# EAGLE design breakout (EAGLE 6.5.0)
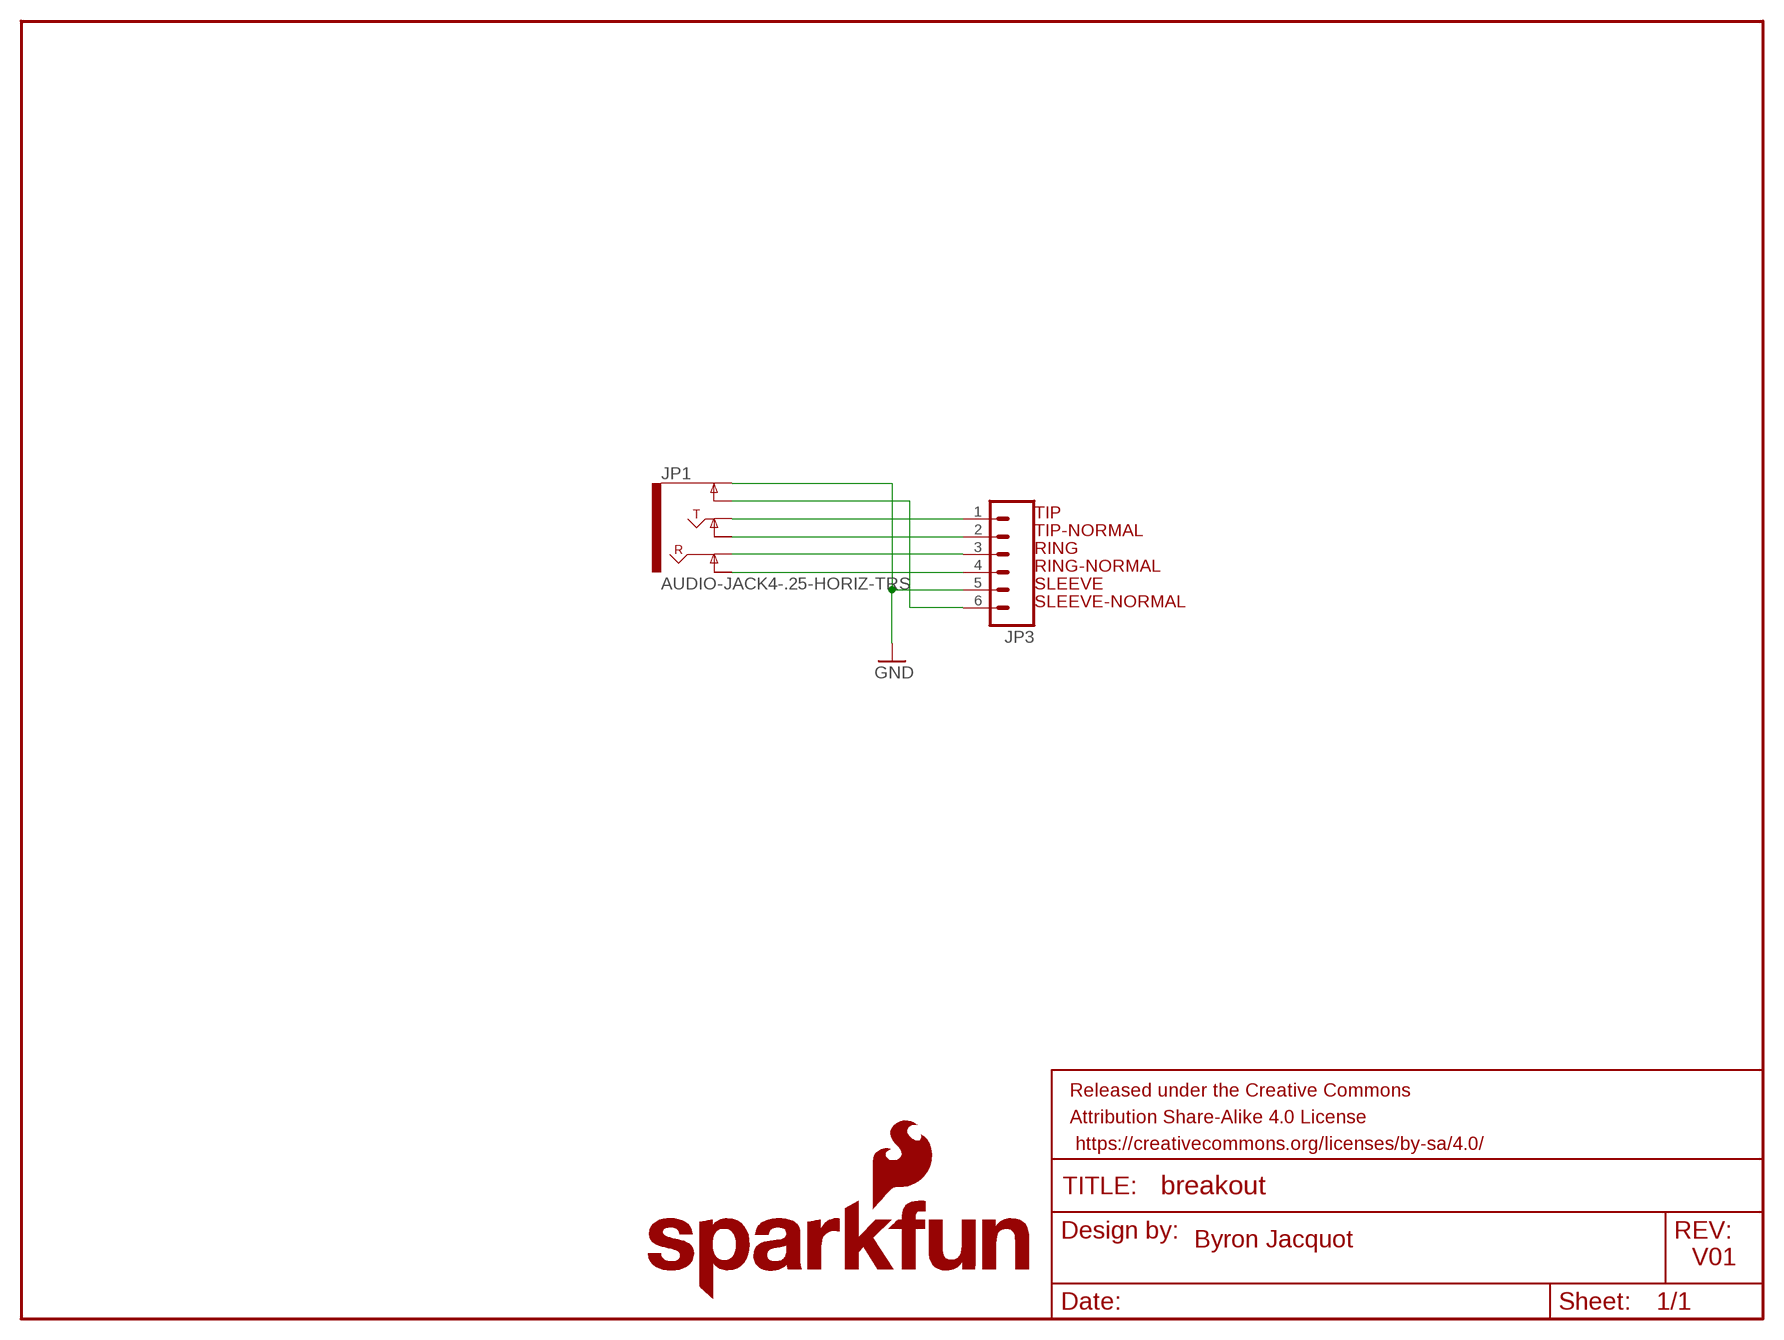
[diagram p0: schematic, sheet 1]

## Parts
FRAME1  FRAME-LETTER  [CREATIVE_COMMONS]
JP1  AUDIO-JACK4-.25-HORIZ-TRS  [AUDIO-JACK-.25-INCH-HORIZ-PTH]
JP3  M06NO_SILK  [1X06_NO_SILK]
LOGO1  SFE_LOGO_NAME_FLAME.1_INCH  [SFE_LOGO_NAME_FLAME_.1]

## Nets
GND: JP1.SLEEVE(EARTH) JP3.5
N$1: JP1.TIP JP3.1
N$2: JP1.TIP-NORM JP3.2
N$3: JP1.RING JP3.3
N$4: JP1.RING-NORM JP3.4
N$6: JP1.SLEEVE-NORM(EARTH-NORM) JP3.6

## Notes on the sheet
- TIP
- TIP-NORMAL
- RING
- RING-NORMAL
- SLEEVE
- SLEEVE-NORMAL
- Byron Jacquot
- V01

## Library data of the parts
FRAME1 = SparkFun-Aesthetics:FRAME-LETTER: Schematic Frame Standard 8.5x11 US Letter frame
JP1 = SparkFun-Connectors:AUDIO-JACK4-.25-HORIZ-TRS: 1/4" TRS jack, horizontal Production SKU: COM-11144 Footprint unproven - datasheet and part seem to be slightly different; PROD_ID: COM-11144
JP3 = SparkFun-Connectors:M06: Header 6 Standard 6-pin 0.1" header. Use with straight break away headers (SKU : PRT-00116), right angle break away headers (PRT-00553), swiss pins (PRT-00743), machine pins (PRT-00117), and female headers (PRT-00115). Molex polarized connector foot print use with SKU : PRT-08094 with associated crimp pins and housings. NOTES ON THE VARIANTS LOCK and LOCK_LONGPADS... This footprint was designed to help hold the alignment of a through-hole component (i.e. 6-pin header) while soldering it into place. You may notice that each hole has been shifted either up or down by 0.005 of an inch from it's more standard position (which is a perfectly straight line). This slight alteration caused the pins (the squares in the middle) to touch the edges of the holes. Because they are alternating, it causes a "brace" to hold the component in place. 0.005 has proven to be the perfect amount of "off-center" position when using our standard breakaway headers. Although looks a little odd when you look at the bare footprint, once you have a header in there, the alteration is very hard to notice. Also,if you push a header all the way into place, it is covered up entirely on the bottom side. This idea of altering the position of holes to aid alignment will be further integrated into the Sparkfun Library for other footprints. It can help hold any component with 3 or more connection pins.
LOGO1 = SparkFun-Aesthetics:SFE_LOGO_NAME_FLAME: SFE Logo, name and flame This is the SparkFun full logo. The logo on the schematic will always be the same size; the package variant is the height of the flame part of the logo. Default layer for the logo on the board is tSilk.

## Board
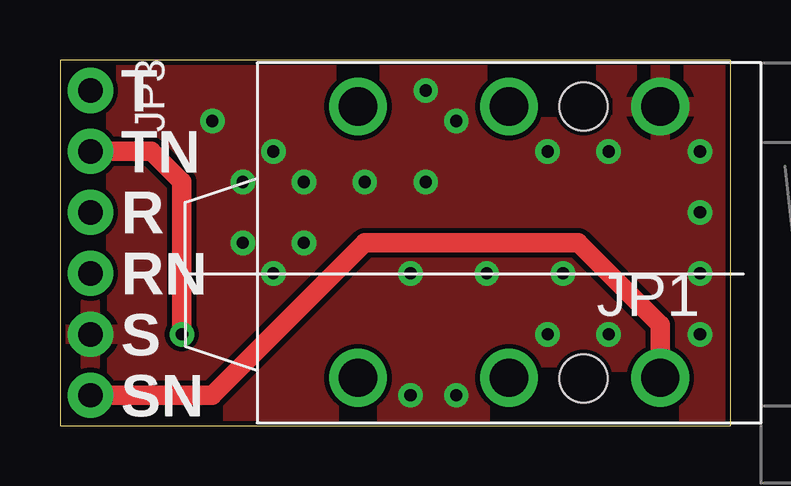
[diagram p1: board, top side]
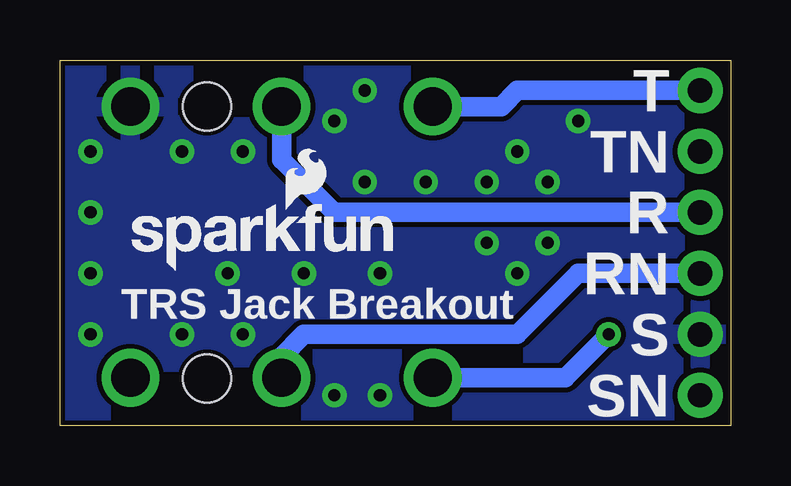
[diagram p2: board, bottom side, seen from below]

Size 27.94 x 15.24 mm. Coordinates in mm from the lower left corner, seen from the top.
Outline: 27.94,15.24 0,15.24 0,0 27.94,0 27.94,15.24
Copper layers (1*16): Top 0.035mm / dielectric 1.5mm / Bottom 0.035mm
Design rules "SparkFun-2-layer": minimum track width 7mil, minimum drill 15mil, track to track 8mil, track to pad 8mil, pad to pad 8mil, via to via 8mil, smd to smd 8mil, copper to edge 8mil, drill to drill 8mil, minimum pad ring 12mil, minimum via ring 10mil, stop-mask expansion 4mil, vias tented up to drill 20mil, thermal gap 10mil

### Footprints (pad centres in the part's own frame; a part is rotated, then mirrored left to right if it is on the bottom)
AUDIO-JACK-.25-INCH-HORIZ-PTH = drill 1.6: RING 10.5,-6.95; RING-NORM 10.5,4.35; SLEEVE 4.2,-6.95; SLEEVE-NORM 4.2,4.35; TIP 16.8,-6.95; TIP-NORM 16.8,4.35 | hole 2: 7.4,4.38; 7.4,-6.95
1X06_NO_SILK = drill 1.016 pad 1.88: 1 0,0; 2 2.54,0; 3 5.08,0; 4 7.62,0; 5 10.16,0; 6 12.7,0

### Placement (x,y rotation side)
FRAME1  21.59,-10.16 0 top  (outside the outline)
JP1  29.21,6.35 180 top
JP3  1.27,13.97 270 top
LOGO1  25.4,6.35 0 bottom

### Tracks (layer width: path | path; a pad name or v marks a point on that pad's centre or on a via)
GND  (via drill 0.51)
  other vias: 16.51,12.7 15.24,10.16 12.7,10.16 10.16,10.16 7.62,10.16 6.35,12.7 8.89,11.43 15.24,13.97 17.78,6.35 20.32,3.81 16.51,1.27 14.61,1.27 14.61,6.35 20.95,6.35 22.86,3.81 10.16,7.62 8.89,6.35 7.62,7.62 26.67,11.43 26.67,8.89 26.67,6.35 26.67,3.81 22.86,11.43 20.32,11.43
  pour Top: 0,15.24 0,0 27.94,0 27.94,15.24
  pour Bottom: 0,15.24 27.94,15.24 27.94,0 0,0
N$1
  Bottom 0.813: JP1.TIP 9.56,13.3 8.89,13.97 JP3.1
N$2  (via drill 0.51)
  Top 0.813: v5.08,3.81 5.08,10.16 3.81,11.43 JP3.2
  Bottom 0.813: JP1.TIP-NORM 6.89,2 v5.08,3.81
N$3
  Bottom 0.813: JP1.RING 18.71,11.09 16.51,8.89 JP3.3
N$4
  Bottom 0.813: JP3.4 6.35,6.35 8.89,3.81 17.78,3.81 18.71,2.88 JP1.RING-NORM
N$6
  Top 0.813: JP3.6 6.35,1.27 12.7,7.62 21.59,7.62 25.01,4.2 JP1.SLEEVE-NORM

### Text on the board
tPlace: T | TN | R | RN | S | SN
bPlace: T | TN | R | RN | TRS Jack Breakout | S | SN